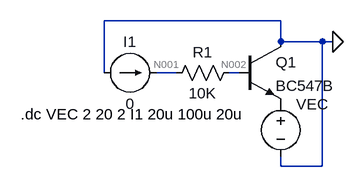
[diagram p0: schematic Draft3.asc]
Draft3.asc, the LTspice schematic file:
Version 4.1
SHEET 1 880 680
WIRE 176 80 -96 80
WIRE 176 112 176 80
WIRE 240 112 176 112
WIRE 256 112 240 112
WIRE -96 160 -96 80
WIRE 16 160 -16 160
WIRE 112 160 96 160
WIRE 176 304 176 288
WIRE 240 304 240 112
WIRE 240 304 176 304
FLAG 256 112 0
SYMBOL npn 112 112 R0
SYMATTR InstName Q1
SYMATTR Value BC547B
SYMBOL res 112 144 R90
WINDOW 0 0 56 VBottom 2
WINDOW 3 32 56 VTop 2
SYMATTR InstName R1
SYMATTR Value 10K
SYMBOL voltage 176 192 R0
SYMATTR InstName VEC
SYMATTR Value ""
SYMBOL current -96 160 R270
WINDOW 0 32 40 VTop 2
WINDOW 3 -32 40 VBottom 2
WINDOW 123 0 0 Left 0
WINDOW 39 0 0 Left 0
SYMATTR InstName I1
SYMATTR Value 0
TEXT -224 224 Left 2 !.dc VEC 2 20 2 I1 20u 100u 20u

The netlist it stands for:
* Draft3.asc
Q1 0 N002 P001 0 BC547B
R1 N002 N001 10K
VEC P001 0
I1 0 N001 0
.model NPN NPN
.model PNP PNP
.lib standard.bjt
.dc VEC 2 20 2 I1 20u 100u 20u
.backanno
.end

* Results of the author's LTspice run, read from the files saved beside the schematic
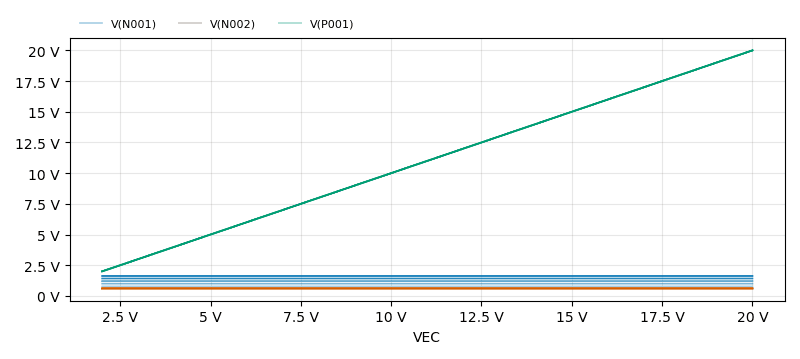
[diagram p1: DC transfer characteristic of Draft3.asc, plotted from the saved traces]
* DC transfer characteristic, 5 runs:
*   V(N001) [I1=2e-05]: 781 mV at VEC=2 V, 781.1 mV at VEC=20 V, min 781 mV, max 781.1 mV
*   V(N001) [I1=4e-05]: 999.9 mV at VEC=2 V, 1 V at VEC=20 V, min 999.9 mV, max 1 V
*   V(N001) [I1=6e-05]: 1.211 V at VEC=2 V, 1.211 V at VEC=20 V, min 1.211 V, max 1.211 V
*   V(N001) [I1=8e-05]: 1.419 V at VEC=2 V, 1.419 V at VEC=20 V, min 1.419 V, max 1.419 V
*   V(N001) [I1=0.0001]: 1.625 V at VEC=2 V, 1.625 V at VEC=20 V, min 1.625 V, max 1.625 V
*   V(N002) [I1=2e-05]: 581 mV at VEC=2 V, 581.1 mV at VEC=20 V, min 581 mV, max 581.1 mV
*   V(N002) [I1=4e-05]: 599.9 mV at VEC=2 V, 600.1 mV at VEC=20 V, min 599.9 mV, max 600.1 mV
*   V(N002) [I1=6e-05]: 611 mV at VEC=2 V, 611.3 mV at VEC=20 V, min 611 mV, max 611.3 mV
*   V(N002) [I1=8e-05]: 618.9 mV at VEC=2 V, 619.2 mV at VEC=20 V, min 618.9 mV, max 619.2 mV
*   V(N002) [I1=0.0001]: 625.1 mV at VEC=2 V, 625.5 mV at VEC=20 V, min 625.1 mV, max 625.5 mV
*   V(P001) [I1=2e-05]: 2 V at VEC=2 V, 20 V at VEC=20 V, min 2 V, max 20 V
*   V(P001) [I1=4e-05]: 2 V at VEC=2 V, 20 V at VEC=20 V, min 2 V, max 20 V
*   V(P001) [I1=6e-05]: 2 V at VEC=2 V, 20 V at VEC=20 V, min 2 V, max 20 V
*   V(P001) [I1=8e-05]: 2 V at VEC=2 V, 20 V at VEC=20 V, min 2 V, max 20 V
*   V(P001) [I1=0.0001]: 2 V at VEC=2 V, 20 V at VEC=20 V, min 2 V, max 20 V